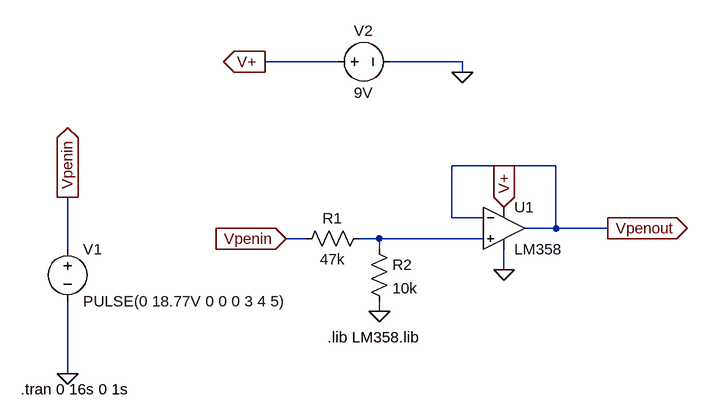
[diagram p0: schematic ssc-plsc-simulation.asc]
ssc-plsc-simulation.asc, the LTspice schematic file:
Version 4
SHEET 1 880 680
WIRE -64 -96 -176 -96
WIRE 128 -96 16 -96
WIRE 128 -80 128 -96
WIRE 272 64 112 64
WIRE 112 144 112 64
WIRE 160 144 112 144
WIRE 272 160 272 64
WIRE 272 160 224 160
WIRE 352 160 272 160
WIRE -112 176 -144 176
WIRE 0 176 -32 176
WIRE 160 176 0 176
WIRE -480 192 -480 112
WIRE 0 192 0 176
WIRE 192 224 192 192
WIRE 0 288 0 272
WIRE -480 384 -480 272
FLAG 192 224 0
FLAG 352 160 Vpenout
IOPIN 352 160 Out
FLAG -144 176 Vpenin
IOPIN -144 176 In
FLAG 0 288 0
FLAG -480 112 Vpenin
IOPIN -480 112 Out
FLAG -480 384 0
FLAG -176 -96 V+
IOPIN -176 -96 Out
FLAG 128 -80 0
FLAG 192 128 V+
IOPIN 192 128 In
SYMBOL OpAmps\\opamp2 192 96 R0
SYMATTR InstName U1
SYMATTR Value LM358
SYMBOL res -16 160 R90
WINDOW 0 0 56 VBottom 2
WINDOW 3 32 56 VTop 2
SYMATTR InstName R1
SYMATTR Value 47k
SYMBOL res -16 176 R0
SYMATTR InstName R2
SYMATTR Value 10k
SYMBOL voltage -480 176 R0
WINDOW 123 0 0 Left 0
WINDOW 39 0 0 Left 0
SYMATTR InstName V1
SYMATTR Value PULSE(0 18.77V 0 0 0 3 4 5)
SYMBOL voltage -80 -96 R270
WINDOW 0 32 56 VTop 2
WINDOW 3 -32 56 VBottom 2
SYMATTR InstName V2
SYMATTR Value 9V
TEXT -80 328 Left 2 !.lib LM358.lib
TEXT -552 408 Left 2 !.tran 0 16s 0 1s

The netlist it stands for:
* ssc-plsc-simulation.asc
XU1 N001 Vpenout V+ 0 Vpenout LM358  ; pins In+ In- V+ V- OUT
R1 N001 Vpenin 47k
R2 N001 0 10k
V1 Vpenin 0 PULSE(0 18.77V 0 0 0 3 4 5)
V2 V+ 0 9V
.lib LM358.lib
.tran 0 16s 0 1s
.backanno
.end